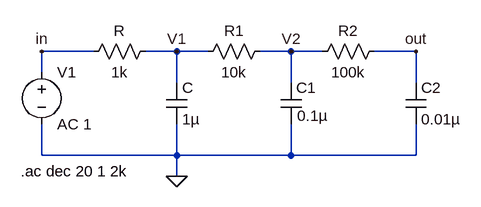
[diagram p0: schematic RC_lowpass Cascaded Filter.asc]
RC_lowpass Cascaded Filter.asc, the LTspice schematic file:
Version 4
SHEET 1 968 680
WIRE 112 32 32 32
WIRE 240 32 192 32
WIRE 288 32 240 32
WIRE 416 32 368 32
WIRE 464 32 416 32
WIRE 608 32 544 32
WIRE 32 64 32 32
WIRE 240 80 240 32
WIRE 416 80 416 32
WIRE 608 80 608 32
WIRE 32 192 32 144
WIRE 240 192 240 144
WIRE 240 192 32 192
WIRE 416 192 416 144
WIRE 416 192 240 192
WIRE 608 192 608 144
WIRE 608 192 416 192
WIRE 240 224 240 192
FLAG 608 32 out
FLAG 32 32 in
FLAG 240 224 0
FLAG 240 32 V1
FLAG 416 32 V2
SYMBOL cap 224 80 R0
SYMATTR InstName C
SYMATTR Value 1µ
SYMBOL res 208 16 R90
WINDOW 0 0 56 VBottom 2
WINDOW 3 32 56 VTop 2
SYMATTR InstName R
SYMATTR Value 1k
SYMBOL voltage 32 48 R0
SYMATTR InstName V1
SYMATTR Value AC 1
SYMBOL cap 400 80 R0
WINDOW 3 25 51 Left 2
SYMATTR InstName C1
SYMATTR Value 0.1µ
SYMBOL cap 592 80 R0
SYMATTR InstName C2
SYMATTR Value 0.01µ
SYMBOL res 384 16 R90
WINDOW 0 0 56 VBottom 2
WINDOW 3 32 56 VTop 2
SYMATTR InstName R1
SYMATTR Value 10k
SYMBOL res 560 16 R90
WINDOW 0 0 56 VBottom 2
WINDOW 3 32 56 VTop 2
SYMATTR InstName R2
SYMATTR Value 100k
TEXT 0 216 Left 2 !.ac dec 20 1 2k

The netlist it stands for:
* RC_lowpass Cascaded Filter.asc
C V1 0 1µ
R V1 in 1k
V1 in 0 AC 1
C1 V2 0 0.1µ
C2 out 0 0.01µ
R1 V2 V1 10k
R2 out V2 100k
.ac dec 20 1 2k
.backanno
.end

* Results of the author's LTspice run, read from the files saved beside the schematic
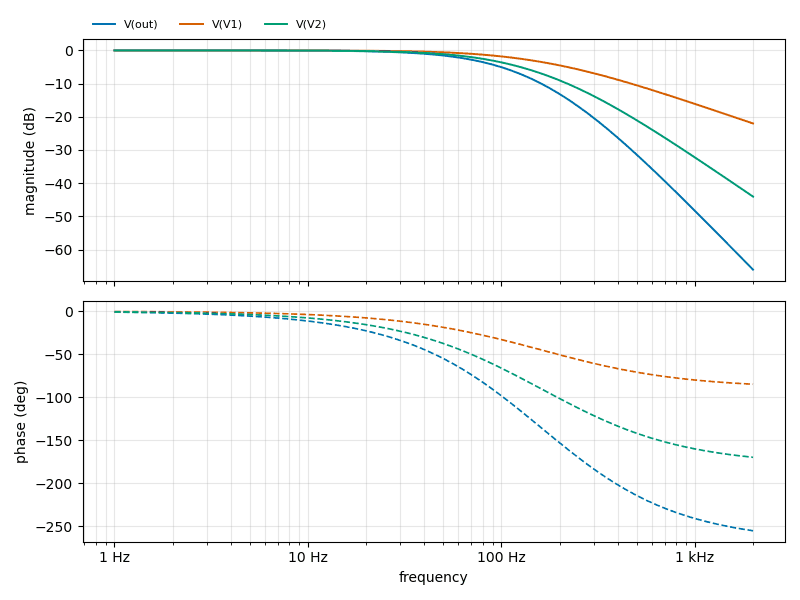
[diagram p1: AC Analysis of RC_lowpass Cascaded Filter.asc, plotted from the saved traces]
* AC Analysis, 1 run:
*   V(out): -0.00 dB at 1 Hz, -66.06 dB at 2 kHz, peak -0.00 dB at 1 Hz, 3 dB below the peak at 72.88 Hz
*   V(V1): -0.00 dB at 1 Hz, -22.02 dB at 2 kHz, peak -0.00 dB at 1 Hz, 3 dB below the peak at 143.5 Hz
*   V(V2): -0.00 dB at 1 Hz, -44.05 dB at 2 kHz, peak -0.00 dB at 1 Hz, 3 dB below the peak at 89.02 Hz